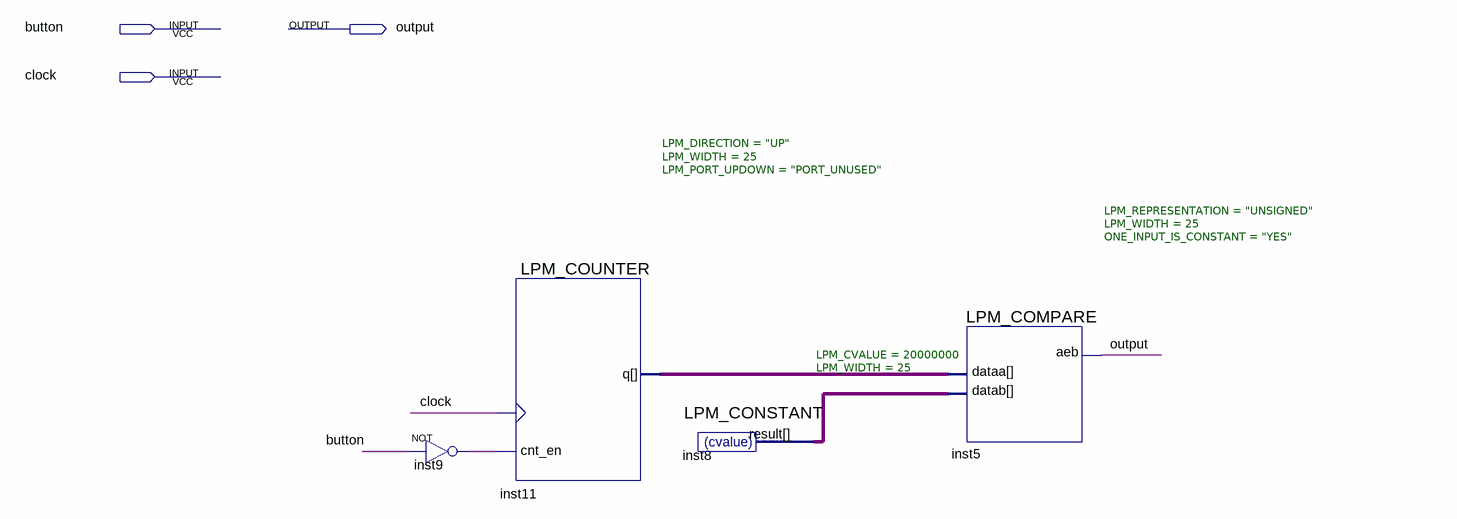
[diagram p0: schematic sheet]
// Quartus schematic g03_debouncer.bdf as structural Verilog: 4 symbols, 3 pins
module g03_debouncer (
  input  button,
  input  clock,
  output \output 
);

  wire inst9_out;
  wire [24:0] inst8_result, inst11_q;

  not inst9 (inst9_out, button);
  LPM_COUNTER #(.LPM_DIRECTION("UP"), .LPM_WIDTH(25), .LPM_PORT_UPDOWN("PORT_UNUSED")) inst11 (
    .clock(clock), .cnt_en(inst9_out), .q(inst11_q));
  LPM_CONSTANT #(.LPM_CVALUE(20000000), .LPM_WIDTH(25)) inst8 (.result(inst8_result));
  LPM_COMPARE #(.LPM_REPRESENTATION("UNSIGNED"), .LPM_WIDTH(25), .ONE_INPUT_IS_CONSTANT("YES")) inst5 (
    .dataa(inst11_q), .datab(inst8_result), .aeb(\output ));
endmodule
